# EAGLE design powerbrain2 (EAGLE 8.3.1)
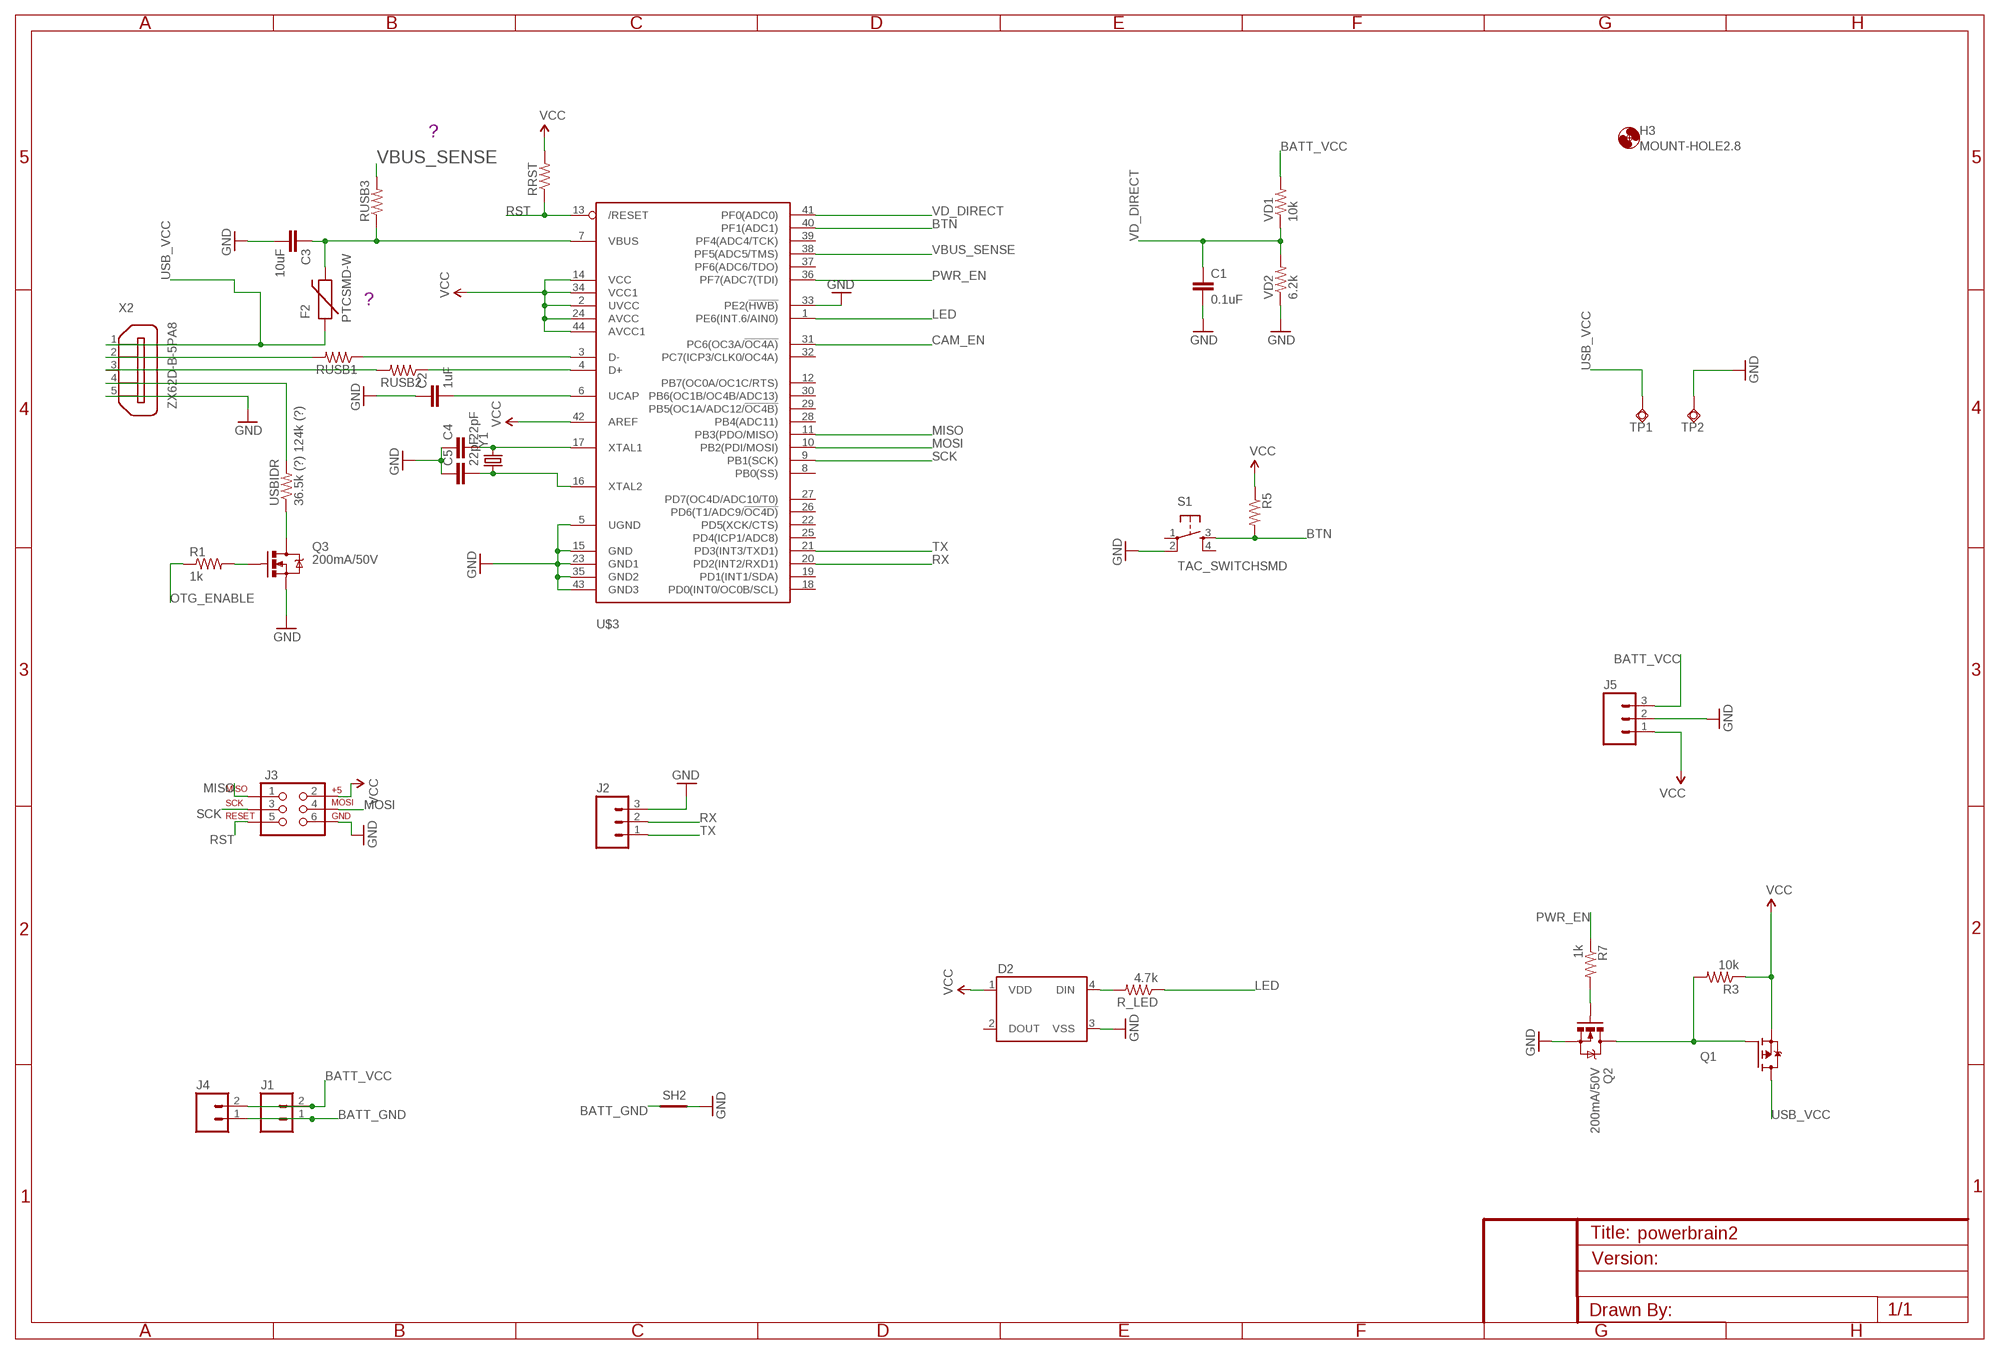
[diagram p0: schematic, sheet 1]

## Parts
C1  0.1uF  CAP1206  [1206]
C2  1uF  CAP1206  [1206]
C3  10uF  CAP1206  [1206]
C4  22pF  CAP1206  [1206]
C5  22pF  CAP1206  [1206]
D2  WS2812B  [WS2812B]
F2  PTCSMD-W  [PTC-1206-WIDE]
H3  MOUNT-HOLE2.8  [2,8]
J1  M02LOCK  [1X02_LOCK]
J2  M03PTH  [1X03]
J3  AVR_SPI_PRG_6PTH  [2X3]
J4  M02LOCK  [1X02_LOCK]
J5  M03LOCK  [1X03_LOCK]
Q1  FDD4141TO252  [TO252]
Q2  200mA/50V  MOSFET-NCHANNELBSS138  [SOT23-3]
Q3  200mA/50V  MOSFET-NCHANNELBSS138  [SOT23-3]
R1  1k  RESISTOR1206  [1206]
R3  10k  RESISTOR1206  [1206]
R5  RESISTOR1206  [1206]
R7  1k  RESISTOR1206  [1206]
R_LED  4.7k  RESISTOR1206  [1206]
RRST  RESISTOR1206  [1206]
RUSB1  RESISTOR1206  [1206]
RUSB2  RESISTOR1206  [1206]
RUSB3  RESISTOR1206  [1206]
S1  TAC_SWITCHSMD  TAC_SWITCHPTH  [TACTILE-PTH]
SH2  SHORT-HT5  [SHORT_TOP-50]
TP1  TPSQTP20R  [TP20R]
TP2  TPSQTP20R  [TP20R]
U$3  ATMEGA32U4-AU  [TQFP44]
USBIDR  36.5k (?) 124k (?)  RESISTOR1206  [1206]
VD1  10k  RESISTOR1206  [1206]
VD2  6.2k  RESISTOR1206  [1206]
X2  ZX62D-B-5PA8  [ZX62D-B-5PA8]
Y1  CRYSTALCRYSTAL-SMD-5X3-16MHZ  [CRYSTAL-SMD-5X3]

## Nets
$N23: C3.1 F2.2 RUSB3.1 U$3.7(VBUS)
BATT_GND: J1.1 J4.1 SH2.1
BATT_VCC [camera_power]: J1.2 J4.2 J5.3 VD1.2
BTN: R5.2 S1.3 U$3.40(PF1(ADC1))
CAM_EN: U$3.31(PC6(OC3A/!OC4A))
GND: C1.2 C2.1 C3.2 C4.1 C5.1 D2.3(VSS) J2.3 J3.6 J5.2 Q2.2(S) Q3.2(S) S1.2 SH2.2 TP2.TP U$3.5(UGND) U$3.15(GND) U$3.23(GND1) U$3.33(PE2(!HWB)) U$3.35(GND2) U$3.43(GND3) VD2.1 X2.5
LED: R_LED.1 U$3.1(PE6(INT.6/AIN0))
MISO: J3.1 U$3.11(PB3(PDO/MISO))
MOSI: J3.4 U$3.10(PB2(PDI/MOSI))
N$1: USBIDR.2 X2.4
N$2: Q3.3(D) USBIDR.1
N$3: Q3.1(G) R1.2
N$4: RUSB1.1 U$3.3(D-)
N$5: RUSB2.1 U$3.4(D+)
N$6: Q1.1(G) Q2.3(D) R3.2
N$7: D2.4(DIN) R_LED.2
N$8: C4.2 U$3.17(XTAL1) Y1.3
N$9: C5.2 U$3.16(XTAL2) Y1.1
N$10: RUSB1.2 X2.2
N$11: RUSB2.2 X2.3
N$12: Q2.1(G) R7.2
N$20: C2.2 U$3.6(UCAP)
OTG_ENABLE: R1.1
PWR_EN: R7.1 U$3.36(PF7(ADC7(TDI))
RST: J3.5 RRST.1 U$3.13(/RESET)
RX: J2.2 U$3.20(PD2(INT2/RXD1))
SCK: J3.3 U$3.9(PB1(SCK))
TX: J2.1 U$3.21(PD3(INT3/TXD1))
USB_VCC: F2.1 Q1.3(D) TP1.TP X2.1
VBUS_SENSE: RUSB3.2 U$3.38(PF5(ADC5/TMS))
VCC [power]: D2.1(VDD) J3.2 J5.1 Q1.2(S) R3.1 R5.1 RRST.2 U$3.2(UVCC) U$3.14(VCC) U$3.24(AVCC) U$3.34(VCC1) U$3.42(AREF) U$3.44(AVCC1)
VD_DIRECT: C1.1 U$3.41(PF0(ADC0)) VD1.1 VD2.2
Unconnected: D2.2(DOUT) S1.1 S1.4 U$3.8(PB0(SS)) U$3.12(PB7(OC0A/OC1C/RTS)) U$3.18(PD0(INT0/OC0B/SCL)) U$3.19(PD1(INT1/SDA)) U$3.22(PD5(XCK/CTS)) U$3.25(PD4(ICP1/ADC8)) U$3.26(PD6(T1/ADC9/!OC4D)) U$3.27(PD7(OC4D/ADC10/T0)) U$3.28(PB4(ADC11)) U$3.29(PB5(OC1A/ADC12/!OC4B)) U$3.30(PB6(OC1B/OC4B/ADC13)) U$3.32(PC7(ICP3/CLK0/OC4A)) U$3.37(PF6(ADC6/TDO)) U$3.39(PF4(ADC4/TCK)) X2.S1 X2.S2 X2.S3 X2.S4

## Notes on the sheet
- ?
- ?

## Library data of the parts
C1 C3-C5 = SparkFun-Passives:CAP: Capacitor Standard 0603 ceramic capacitor, and 0.1" leaded capacitor.
C2 = SparkFun-Capacitors:CAP: Capacitor Standard 0603 ceramic capacitor, and 0.1" leaded capacitor.
D2 = SparkFun-LED:WS2812B: WS2812B - Intelligent control LED integrated light source Technical Specifications: Power Supply Voltage (VDD): 3.5 to 5.3 V Input Voltage (VI): -0.5 to VDD+0.5 V Operating Junction Temperature (Topt): -25°C to +80°C Storage Temperature Range (Tstg): -55°C to +150°C; PROD_ID: DIO-12503
F2 = SparkFun-PowerIC:PTC: Resettable Fuse PTC Resettable Fuse. Spark Fun Electronics SKU : COM-08357
H3 = holes:MOUNT-HOLE: MOUNTING HOLE with drill center marker
J1 J4 = SparkFun-Connectors:M02: Standard 2-pin 0.1" header. Use with - straight break away headers ( PRT-00116) - right angle break away headers (PRT-00553) - swiss pins (PRT-00743) - machine pins (PRT-00117) - female headers (PRT-00115) Molex polarized connector foot print use with: PRT-08233 with associated crimp pins and housings. 2.54_SCREWTERM for use with PRT-10571. 3.5mm Screw Terminal footprints for PRT-08084 5mm Screw Terminal footprints for use with PRT-08432
J2 J5 = SparkFun-Connectors:M03: Header 3 Standard 3-pin 0.1" header. Use with straight break away headers (SKU : PRT-00116), right angle break away headers (PRT-00553), swiss pins (PRT-00743), machine pins (PRT-00117), and female headers (PRT-00115). Molex polarized connector foot print use with SKU : PRT-08232 with associated crimp pins and housings.
J3 = SparkFun-Connectors:AVR_SPI_PRG_6: AVR ISP 6 Pin This is the reduced ISP connector for AVR programming. Common on Arduino. This footprint will take up less PCB space and can be used with a 10-pin to 6-pin adapter such as SKU: BOB-08508 **Special note about "TEST_POINT" package. The stop mask is on the top side, so if you want your programming test points to be on the bottom of your board, make sure to place this package on the bottom side of the board. This also ensure that the orientation to program from the bottom side will be correct.
Q1 = transistor-fet:FDD4141: P-Channel PowerTrench® MOSFET Source: FDD4141.pdf
Q2 Q3 = SparkFun-DiscreteSemi:MOSFET-NCHANNEL: Common NMOSFET Parts MFG P/N Store ID Prod ID FDD8780 TRANS-09984 SI7820DN TRANS-11055 FDS6630A IC-08089 2N7002PW TRANS-11151 FQP30N06L COM-10213 TRANS-10060 BSS123LT1G TRANS-08345 BSS138 TRANS-00830 BS170 2N7000; PROD_ID: TRANS-00830
R1 R3 R7 R_LED = SparkFun-Resistors:RESISTOR: Resistor Basic schematic elements and footprints for 0603, 1206, and PTH resistors.
R5 RRST RUSB1-RUSB3 USBIDR VD1 VD2 = SparkFun-Passives:RESISTOR: Resistor Basic schematic elements and footprints for 0603, 1206, and PTH resistors.
S1 = SparkFun-Retired:TAC_SWITCH: Momentary Switch Button commonly used for reset or general input. Spark Fun Electronics SKU : COM-00097 SMT- SWCH-08247
SH2 = shorts:SHORT-H: Short between two nets; BOM: no
TP1 TP2 = testpad:TPSQ: Test pad
U$3 = adafruit:ATMEGA32U4: http://www.ladyada.net/library/eagle
X2 = zx62d-b-5pa8-oshpark_10:ZX62D-B-5PA8: Micro USB Type B Connector - Standard, Shell Through Hole Source: http://www.hirose.co.jp/cataloge_hp/ed_ZX_20140804.pdf; MF: Hirose; MPN: ZX62D-B-5PA8; OC_FARNELL: 2300438; OC_NEWARK: 69W0712
Y1 = SparkFun-FreqCtrl:CRYSTAL: Various standard crystals. Proven footprints.; PROD_ID: XTAL-08218

## Net classes
0 default: width 0.254 mm, clearance 0.254 mm
1 power: width 0.457 mm, clearance 0.254 mm
2 camera_power: width 0.66 mm, clearance 0.254 mm
3 usbsignal: width 0.254 mm, clearance 0.203 mm

## Board
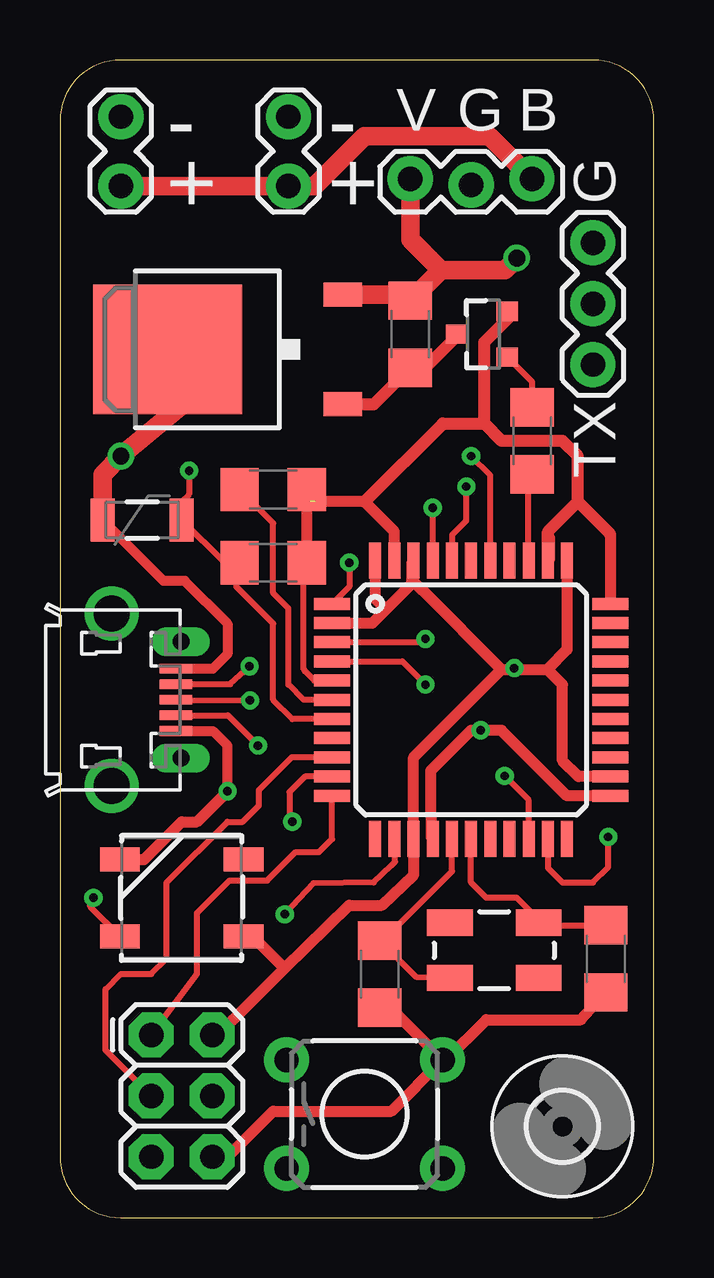
[diagram p1: board, top side]
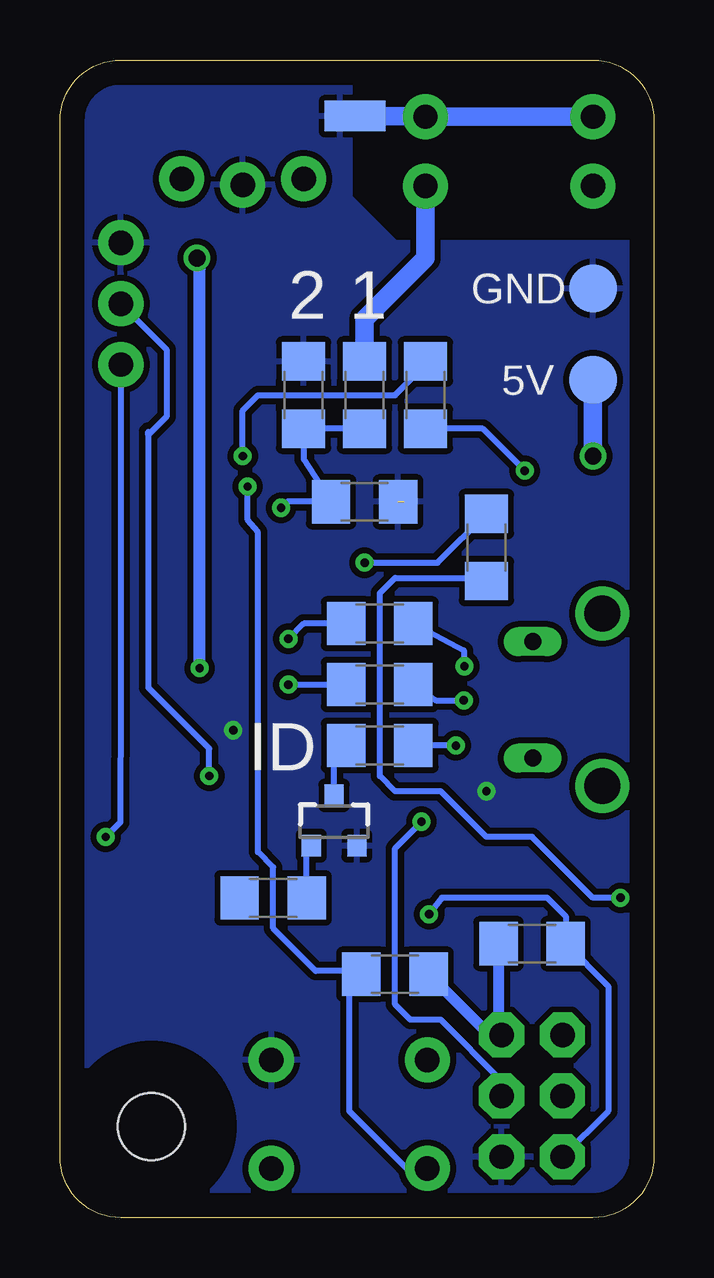
[diagram p2: board, bottom side, seen from below]

Size 24.77 x 48.26 mm. Coordinates in mm from the lower left corner, seen from the top.
Outline: 0,2.54 arc90 2.54,0 22.23,0 arc90 24.77,2.54 24.77,45.72 arc90 22.23,48.26 2.54,48.26 arc90 0,45.72 0,2.54
Copper layers (1*16): Top 0.035mm / dielectric 1.5mm / Bottom 0.035mm
Design rules "default": minimum track width 10mil, minimum drill 24mil, track to track 8mil, track to pad 8mil, pad to pad 8mil, via to via 8mil, smd to smd 8mil, copper to edge 40mil, drill to drill 8mil, minimum pad ring 10mil, minimum via ring 8mil, stop-mask expansion 4mil, vias tented up to drill 0mil, thermal gap 10mil

### Footprints (pad centres in the part's own frame; a part is rotated, then mirrored left to right if it is on the bottom)
1206 = smd 1.6 x 1.8: 1 -1.4,0; 2 1.4,0
WS2812B = smd 1.651 x 1: 1 -2.577,1.6; 2 -2.577,-1.6; 3 2.577,-1.6; 4 2.577,1.6
PTC-1206-WIDE = smd 1 x 1.8: 1 -1.654,0; 2 1.654,0
2,8 = hole 2.8: 0,0
1X02_LOCK = drill 1.016 pad 1.88: 1 -0.178,0; 2 2.718,0
1X03 = drill 1.016 pad 1.88: 1 0,0; 2 2.54,0; 3 5.08,0
2X3 = drill 1.016 pad 1.88 octagon: 1 0,0; 2 0,2.54; 3 2.54,0; 4 2.54,2.54; 5 5.08,0; 6 5.08,2.54
1X03_LOCK = drill 1.016 pad 1.88: 1 0,0.127; 2 2.54,-0.127; 3 5.08,0.127
TO252 = smd 1 x 1.6: 1 -2.28,-4.8; 2 2.28,-4.8 | smd 5.4 x 6.2: 3 0,2.5
SOT23-3 = smd 0.8 x 0.9: 1 -0.95,-1; 2 0.95,-1; 3 0,1.1
TACTILE-PTH = drill 1.016 pad 1.88: 1 -3.251,2.261; 2 3.251,2.261; 3 -3.251,-2.261; 4 3.251,-2.261
SHORT_TOP-50 = smd 1.27 x 1.27: 1 0.635,0; 2 -0.635,0
TP20R = smd 2 x 2: TP 0,0
TQFP44 = smd 1.5 x 0.5: 1 -5.8,4; 2 -5.8,3.2; 3 -5.8,2.4; 4 -5.8,1.6; 5 -5.8,0.8; 6 -5.8,0; 7 -5.8,-0.8; 8 -5.8,-1.6; 9 -5.8,-2.4; 10 -5.8,-3.2; 11 -5.8,-4; 23 5.8,-4; 24 5.8,-3.2; 25 5.8,-2.4; 26 5.8,-1.6; 27 5.8,-0.8; 28 5.8,0; 29 5.8,0.8; 30 5.8,1.6; 31 5.8,2.4; 32 5.8,3.2; 33 5.8,4 | smd 0.5 x 1.5: 12 -4,-5.8; 13 -3.2,-5.8; 14 -2.4,-5.8; 15 -1.6,-5.8; 16 -0.8,-5.8; 17 0,-5.8; 18 0.8,-5.8; 19 1.6,-5.8; 20 2.4,-5.8; 21 3.2,-5.8; 22 4,-5.8; 34 4,5.8; 35 3.2,5.8; 36 2.4,5.8; 37 1.6,5.8; 38 0.8,5.8; 39 0,5.8; 40 -0.8,5.8; 41 -1.6,5.8; 42 -2.4,5.8; 43 -3.2,5.8; 44 -4,5.8
ZX62D-B-5PA8 = smd 1.35 x 0.4: 1 4.825,1.3; 2 4.825,0.65; 3 4.825,0; 4 4.825,-0.65; 5 4.825,-1.3 | drill 1.5: S1 2.15,-3.6; S2 2.15,3.6 | drill 0.7 long: S3 5.05,2.425; S4 5.05,-2.425
CRYSTAL-SMD-5X3 = smd 1.9 x 1.1: 1 -1.85,-1.15; 2 1.85,-1.15; 3 1.85,1.15; 4 -1.85,1.15

### Placement (x,y rotation side)
C1  12.06,29.84 0 bottom
C2  8.89,30.35 180 top
C3  8.89,27.3 0 top
C4  22.76,10.79 90 top
C5  13.34,10.16 90 top
D2  5.08,13.34 180 top
F2  3.43,29.08 0 top
H3  20.95,3.81 0 top
J1  9.53,45.72 270 top
J2  22.23,35.56 90 top
J3  3.81,7.62 270 top
J4  2.54,45.72 270 top
J5  14.61,43.18 0 top
Q1  6.99,36.2 90 top
Q2  17.65,36.83 90 top
Q3  13.34,16.51 0 bottom
R1  15.88,13.34 0 bottom
R3  14.61,36.83 270 top
R5  10.79,10.16 180 bottom
R7  19.68,32.38 90 top
R_LED  6.99,27.94 270 bottom
RRST  5.08,11.43 180 bottom
RUSB1  11.43,24.77 0 bottom
RUSB2  11.43,22.23 0 bottom
RUSB3  9.53,34.29 90 bottom
S1  12.7,4.32 0 top
SH2  12.46,45.92 0 bottom
TP1  2.54,34.92 0 bottom
TP2  2.54,38.73 0 bottom
U$3  17.14,21.59 0 top
USBIDR  11.43,19.68 0 bottom
VD1  12.06,34.29 90 bottom
VD2  14.61,34.29 270 bottom
X2  0,21.59 0 top
Y1  18.11,11.15 0 top

### Tracks (layer width: path | path; a pad name or v marks a point on that pad's centre or on a via)
$N23  (via drill 0.35)
  Top 0.254: U$3.7 9.69,20.79 8.89,21.59 8.89,24.77 7.36,26.29 7.36,27.18 C3.1 6.86,27.3 F2.2 5.08,29.84 5.38,30.15 v5.38,31.14
  Bottom 0.254: v5.38,31.14 7.13,32.89 RUSB3.1
BATT_GND
  Bottom 0.762: J4.1 J1.1 9.55,45.92 SH2.1
BATT_VCC
  Top 0.762: J4.2 J1.2 10.62,43 12.7,45.09 17.91,45.09 J5.3
  Bottom 0.762: VD1.2 12.06,37.47 9.53,40.01 J1.2
BTN  (via drill 0.35)
  Top 0.254: U$3.40 16.36,27.4 16.36,28.47 16.94,29.06 v16.94,30.48
  Bottom 0.254: S1.3 10.31,2.06 12.7,4.45 12.7,9.65 R5.2 12.2,10.29 14.1,10.29 15.88,12.06 15.88,14.61 16.51,15.24 16.51,28.57 16.94,29.08 v16.94,30.48
GND  (via drill 0.35)  (1 unrouted)
  Top 0.254: 11.38,22.35 U$3.5 10.61,22.39 10.21,22.78 10.21,22.81 10.16,22.86 10.16,27.18 C3.2 | C5.1 13.97,8.43 | 2.5,15.2 D2.3
  Top 0.406: X2.5 6.38,20.29 6.99,19.68 v6.99,17.78
  Top 0.457: 13.97,8.43 14.1,8.43 S1.2 | S1.2 16.1,6.58 17.78,8.26 21.72,8.26 C4.1 | D2.3 3.5,14.94 5.08,16.51 5.71,16.51 v6.99,17.78 | U$3.43 13.95,28.6 12.7,29.84 10.42,29.84 C2.1 C3.2 | 22.95,28.49 U$3.33 | 20.41,28.34 20.41,27.46 U$3.35 | U$3.23 21.14,17.59 18.41,20.32 v17.54,20.32 17.14,20.32 15.46,18.63 15.46,16.76 15.48,16.74 15.48,15.86 U$3.15 | J3.6 6.99,2.54 8.89,4.45 13.82,4.45 S1.2
  Top 0.508: 21.59,29.84 21.59,31.75 20.95,32.38 18.41,32.38 17.7,33.1 | 21.59,29.84 22.95,28.49 | U$3.35 20.34,28.6 21.59,29.84 | Q2.2 18.65,37.45 17.7,36.49 17.7,33.1 | 12.7,29.84 15.96,33.1 17.7,33.1
  pour Bottom: 0,0 24.77,0 24.77,48.26 12.7,48.26 12.7,42.55 10.79,40.64 0,40.64
LED  (via drill 0.35)
  Top 0.254: v12.06,27.3 12.06,26.31 U$3.1
  Bottom 0.254: v12.06,27.3 9.02,27.3 R_LED.1
MISO
  Top 0.254: J3.1 5.71,10.16 5.71,12.7 7.07,14.05 8.64,14.05 9.83,15.24 10.79,15.24 11.35,15.79 U$3.11
MOSI  (via drill 0.35)
  Top 0.254: U$3.10 10.21,18.39 9.56,17.74 9.56,16.55 9.53,16.51 v9.69,16.51
  Bottom 0.254: v9.69,16.51 10.79,15.4 10.79,8.89 10.16,8.26 8.89,8.26 6.35,5.71 J3.4
N$1  (via drill 0.35)
  Top 0.254: X2.4 7,20.94 v8.26,19.68
  Bottom 0.254: v8.26,19.68 USBIDR.2
N$2
  Bottom 0.254: Q3.3 13.34,19.18 USBIDR.1
N$3
  Bottom 0.254: R1.2 14.47,15.32 Q3.1
N$4  (via drill 0.35)
  Top 0.254: U$3.3 15.1,23.99 v15.24,24.13
  Bottom 0.254: RUSB1.1 14.61,24.77 v15.24,24.13
N$5  (via drill 0.35)
  Top 0.254: U$3.4 14.28,23.19 v15.24,22.23
  Bottom 0.254: v15.24,22.23 RUSB2.1
N$6
  Top 0.254: 16.55,36.74 Q2.3 | 11.82,33.91 Q1.1
  Top 0.508: Q1.1 13.09,33.91 R3.2 15.24,35.43 16.55,36.74
N$7  (via drill 0.35)
  Top 0.254: D2.4 1.27,12.97 1.27,13.34 v1.39,13.34
  Bottom 0.254: v1.39,13.34 2.54,13.34 5.08,15.88 6.99,15.88 8.89,17.78 10.79,17.78 11.43,18.41 11.43,26.04 10.79,26.67 7.49,26.67 R_LED.2
N$8
  Top 0.254: U$3.17 17.14,13.97 17.78,13.34 19.05,13.34 20.06,12.33 Y1.3 20.4,12.2 C4.2
N$9
  Top 0.254: U$3.16 16.34,14.44 13.97,12.06 C5.2 14.87,10.03 Y1.1
N$10  (via drill 0.35)
  Top 0.254: X2.2 7.1,22.24 v7.9,22.99
  Bottom 0.254: RUSB1.2 7.92,23.65 v7.9,22.99
N$11  (via drill 0.35)
  Top 0.254: X2.3 v7.92,21.57
  Bottom 0.254: RUSB2.2 9.09,21.57 v7.92,21.57
N$12
  Top 0.254: Q2.1 19.68,34.85 R7.2
N$20
  Top 0.254: U$3.6 10.16,21.59 9.53,22.23 9.53,25.4 8.89,26.04 8.89,28.95 C2.2
PWR_EN
  Top 0.254: U$3.36 19.53,27.4 19.53,30.43 19.68,30.58 R7.1
RST  (via drill 0.35)
  Top 0.254: U$3.13 13.97,15.77 13.97,14.83 13.82,14.68 13.08,13.97 10.57,13.95 v9.37,12.65
  Bottom 0.254: v9.37,12.65 8.84,13.34 4.45,13.34 3.68,12.57 RRST.1 1.91,9.65 1.91,4.45 J3.5
RX  (via drill 0.35)
  Top 0.254: U$3.20 19.55,17.41 v18.54,18.41
  Bottom 0.254: v18.54,18.41 18.54,19.56 21.08,22.1 21.08,32.63 | 21.08,32.63 21.08,32.77 | J2.2 20.32,36.2 20.32,33.39 21.08,32.63
SCK
  Top 0.254: U$3.9 9.66,19.19 8.3,17.83 8.3,17.19 7.62,16.51 6.99,16.51 4.45,13.97 4.45,10.79 3.81,10.16 2.54,10.16 1.91,9.53 1.91,8.26 1.91,6.99 J3.3
TX  (via drill 0.35)
  Top 0.254: U$3.21 20.34,14.58 20.95,13.97 22.23,13.97 22.86,14.61 v22.86,15.88
  Bottom 0.254: J2.1 22.23,21.21 22.25,17.17 22.25,16.48 v22.86,15.88
USB_VCC  (via drill 0.7)
  Top 0.406: X2.1 6.38,22.89 6.99,23.5 6.99,24.77 | 6.99,24.77 6.98,24.77 | 6.99,24.77 5.21,26.54 4.32,26.54 F2.1
  Top 0.762: F2.1 1.77,30.98 v2.54,31.75 6.35,34.92 6.35,36.16 Q1.3
  Bottom 0.762: TP1.TP v2.54,31.75
VBUS_SENSE  (via drill 0.35)
  Top 0.254: U$3.38 17.95,30.95 v17.14,31.75
  Bottom 0.254: v17.14,31.75 17.14,33.66 16.51,34.29 10.79,34.29 9.53,35.56 RUSB3.2
VCC  (via drill 0.35, 0.7)
  Top 0.457: J3.2 7.21,8.26 9.36,10.4 | 9.36,10.4 12.06,13.03 13.44,13.03 14.75,14.3 14.75,15.7 U$3.14 14.74,19.19 18.41,22.86 | D2.1 8.02,11.73 9.36,10.4 | U$3.24 21.61,18.39 20.95,19.05 20.95,22.23 20.32,22.86 | 20.32,22.86 19,22.86 v18.94,22.91 18.89,22.86 18.41,22.86 | U$3.34 21.14,23.68 20.32,22.86 | 14.68,26.57 14.68,26.44 13.6,25.36 | 14.68,26.57 14.68,27.32 U$3.42 | U$3.2 13.03,24.79 13.6,25.36 | U$3.44 13.14,25.81 13.6,25.36 | 18.41,22.86 15.12,26.16 15.1,26.16 14.68,26.57
  Top 0.762: v19.05,40.01 18.55,39.5 15.88,39.5 | Q1.2 14.36,38.48 R3.1 15.88,39.5 | 15.88,39.5 14.61,40.77 J5.1
  Bottom 0.457: RRST.2 6.48,8.38 J3.2 6.86,7.62 R5.1
  Bottom 0.508: v18.94,22.91 18.94,39.48 v19.05,40.01
VD_DIRECT  (via drill 0.35)
  Top 0.254: U$3.41 15.54,28.5 15.54,29.26 v15.54,29.59
  Bottom 0.254: VD1.1 VD2.2 14.61,31.62 C1.1 15.29,29.84 v15.54,29.59

### Text on the board
tPlace: V | G | B | - | - | G | + | + | TX
bPlace: GND | 1 | 2 | 5V | ID